# Altium schematic sheet Board_Power.SchDoc: Board Power
size 431 x 279 mm; Author: Eric Liu; SheetNumber: 5; SheetTotal: 6
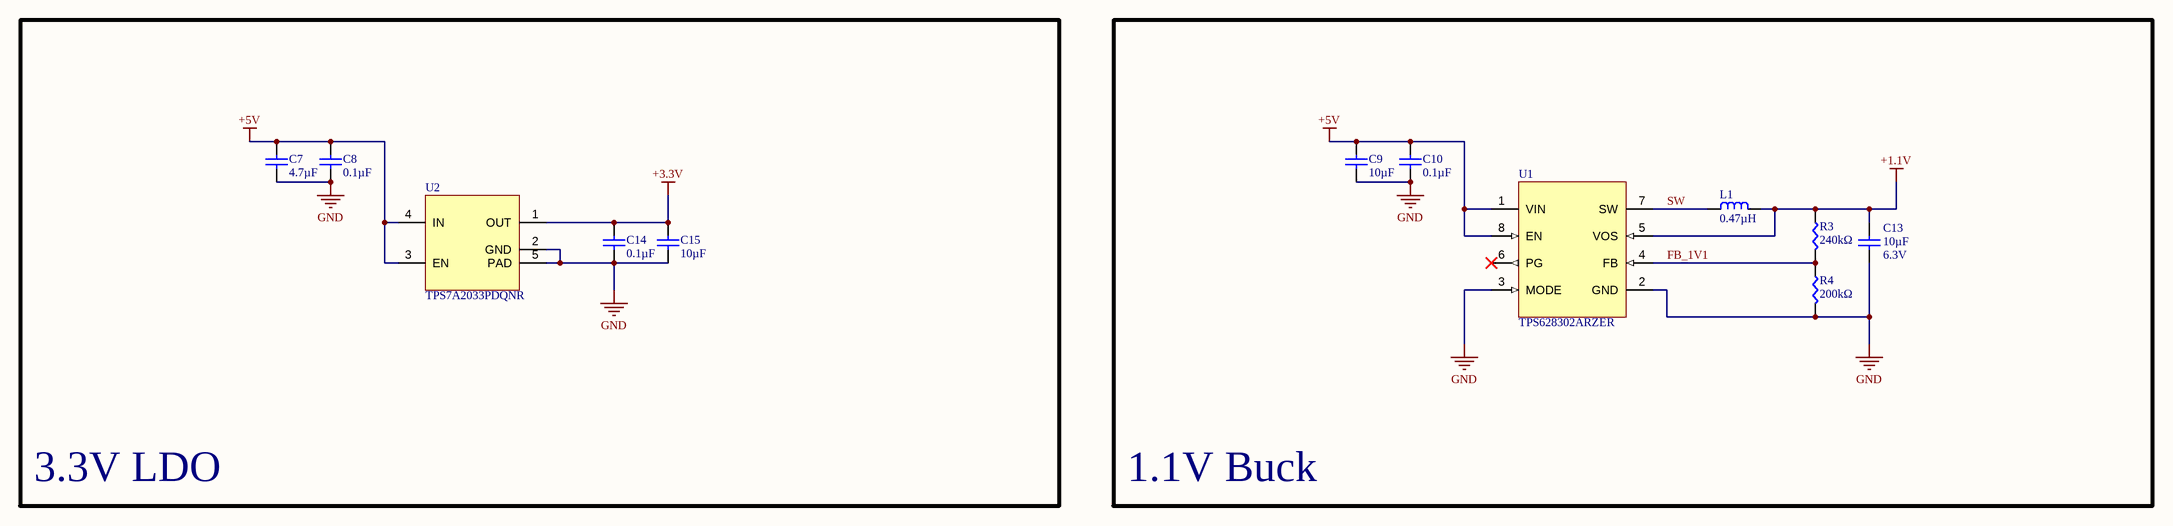
[diagram p0: Board_Power.SchDoc]

## Parts
C7  value 4.7µF  [CAP0603]  (hidden comment: GRT21BR61H475KE13L)
C8  value 0.1µF  [CAP0402]  (hidden comment: CC0402KRX5R9BB104)
C9  value 10µF  [CAP0402]  (hidden comment: GRM1555C1H221JA01D)
C10  value 0.1µF  [CAP0402]  (hidden comment: CC0402KRX5R9BB104)
C13  value 10µF  Voltage: 6.3V  [CAP0402]  (hidden comment: CL05A106MQ5NUNC)
C14  value 0.1µF  [CAP0402]  (hidden comment: CC0402KRX5R9BB104)
C15  value 10µF  [CAP0402]  (hidden comment: CL05A106MQ5NUNC)
L1  value 0.47µH  [IND0806]  (hidden comment: CIGT201610EHR47MNE)
R3  value 240kΩ  [RES0402]  (hidden comment: RC0402FR-0790K9L)
R4  value 200kΩ  [RES0402]  (hidden comment: ERJ-2RKF3002X)
U1  TPS628302ARZER  [WQFN-HR8_RZE_TEX]
U2  TPS7A2033PDQNR  [4-X2SON]

## Blocks framed on the sheet
3.3V LDO: C7 C8 C14 C15 U2
1.1V Buck: C9 C10 C13 L1 R3 R4 U1

## Nets
+1.1V: C13.2 L1.2 R3.2 U1.5(VOS)
+3.3V: C14.2 C15.2 U2.1(OUT)
+5V: C7.2 C8.2 C9.2 C10.2 U1.1(VIN) U1.8(EN) U2.3(EN) U2.4(IN)
GND: C7.1 C8.1 C9.1 C10.1 C13.1 C14.1 C15.1 R4.1 U1.2(GND) U1.3(MODE) U2.2(GND) U2.5(PAD)
FB_1V1: R3.1 R4.2 U1.4(FB)
SW: L1.1 U1.7(SW)

Not connected (* = marked no-connect by the designer): U1 6(PG)*

## Notes on the sheet
- DWG. NO.
- REV.
- SHT.
- THIS DOCUMENT AND THE DATA DISCLOSED HEREIN OR HEREWITH IS THE PROPERTY OF ALTIUM LIMITED AND MAY BE FREELY DISTRIBUTED IN WHOLE. NO RIGHTS ARE RESERVED OR EXPRESS OR IMPLIED WARANTEE GIVEN.
- REVISION
- DESCRIPTION
- DATE
- APPROVED
- ENG:
- APPROVALS
- PROJECT
- DSN:
- CHK:
- REFERENCE DOCUMENTS
- PROJECT REVISION:
- TITLE
- DOCUMENT REVISION:
- DESIGN ITEM:
- BOM:
- FAB DWG:
- PCB DWG:
- ASSY DWG:
- SCALE:
- SIZE
- B
- CAGE CODE
- FILE NAME
- DWG NO.
- SHEET
- OF
- REV

## Library data of the parts
C7 = GRM188R61E475KE11D: 4.7 µF ±10% 25V Ceramic Capacitor X5R 0603 (1608 Metric); Temperature Coefficient: X5R; Package: 0603 (1608 Metric); Voltage: 25V
C8 C10 C14 = CC0402KRX5R9BB104: 0.1 µF ±10% 50V Ceramic Capacitor X5R 0402 (1005 Metric); Temperature Coefficient: X5R; Package: 0402 (1005 Metric); Voltage: 50V
C9 = GRM155R61A106ME11D: 10 µF ±20% 10V Ceramic Capacitor X5R 0402 (1005 Metric); Temperature Coefficient: X5R; Package: 0402 (1005 Metric); Voltage: 10V
C13 C15 = CL05A106MQ5NUNC: 10 µF ±20% 6.3V Ceramic Capacitor X5R 0402 (1005 Metric); Temperature Coefficient: C0G, NP0; Package: 0402 (1005 Metric)
  C15: Voltage: 6.3V
L1 = CIGT201610EHR47MNE: 470 nH Shielded Thin Film Inductor 4.8 A 22mOhm Max 0806 (2016 Metric); Manufacturer 1: Samsung Electro-Mechanics; Current Rating: 4.8A; Current - Saturation (Isat): 5.9A; Manufacturer Part Number 1: CIGT201610EHR47MNE; Supplier Part Number 1: 1276-6902-1-ND; Supplier 1: Digi-Key
R3 = RC0402FR-07240KL: 240 kOhms ±1% 0.063W, 1/16W Chip Resistor 0402 (1005 Metric) Moisture Resistant Thick Film; Manufacturer 1: YAGEO; Manufacturer Part Number 1: RC0402FR-07240KL; Supplier Part Number 1: 311-240KLRCT-ND; Supplier 1: Digi-Key; Power Rating: 1/16W
R4 = ERJ-2RKF2003X: 200 kOhms ±1% 0.1W, 1/10W Chip Resistor 0402 (1005 Metric) Automotive AEC-Q200 Thick Film; Manufacturer 1: Panasonic Electronic Components; Manufacturer Part Number 1: ERJ-2RKF2003X; Supplier Part Number 1: P200KLCT-ND; Supplier 1: Digi-Key; Power Rating: 1/10W
U1 = TPS628302ARZER: Buck Switching Regulator IC Positive Adjustable 0.5V 1 Output 2A 8-WFDFN; Manufacturer: Texas Instruments; Manufacturer Product Number: TPS628302ARZER; Supplier: DigiKey; Supplier Part Number: 296-TPS628302ARZERCT-ND; Datasheet: https://www.ti.com/lit/ds/symlink/tps628302.pdf?ts=1772906536972&ref_url=https%253A%252F%252Fwww.ti.com%252Fproduct%252FTPS628302; Operating Temperature: -40°C ~ 125°C
U2 = TPS7A2033PDQNR: Linear Voltage Regulator IC Positive Fixed 1 Output 300mA 4-X2SON (1x1); Manufacturer: Texas Instruments; Manufacturer Product Number: TPS7A2033PDQNR; Supplier: DigiKey; Supplier Part Number: 296-TPS7A2033PDQNRCT-ND; Datasheet: https://www.ti.com/lit/ds/symlink/tps7a20.pdf?HQS=dis-dk-null-digikeymode-dsf-pf-null-wwe&ts=1772479101747; Operating Temperature: -40°C ~ 125°C